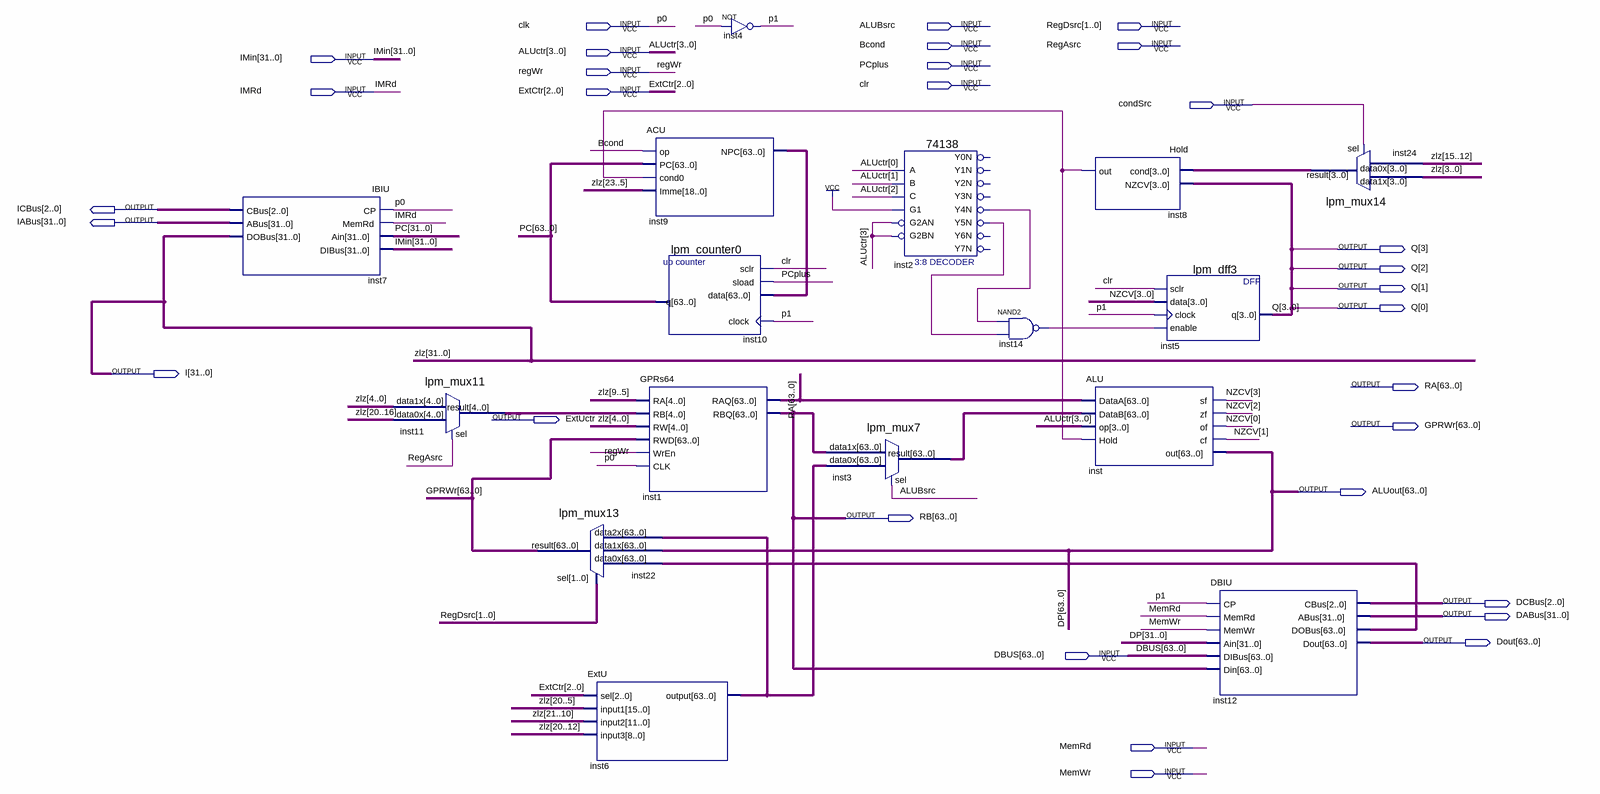
[diagram p0: schematic sheet]
// Quartus schematic DP.bdf as structural Verilog: 16 symbols, 31 pins
module DP (
  input  clk,
  input  ALUBsrc,
  input  [1:0] RegDsrc,
  input  Bcond,
  input  RegAsrc,
  input  [3:0] ALUctr,
  input  [31:0] IMin,
  input  PCplus,
  input  regWr,
  input  clr,
  input  IMRd,
  input  [2:0] ExtCtr,
  input  condSrc,
  input  [63:0] DBUS,
  input  MemRd,
  input  MemWr,
  output [2:0] ICBus,
  output [31:0] IABus,
  output [3:0] Q,
  output [31:0] I,
  output [63:0] RA,
  output ExtUctr,
  output [63:0] GPRWr,
  output [63:0] ALUout,
  output [63:0] RB,
  output [2:0] DCBus,
  output [31:0] DABus,
  output [63:0] Dout
);

  wire inst2_y4n, inst2_y5n, inst8_out, inst14_out, p1;
  wire [3:0] inst24_result, NZCV;
  wire [4:0] inst11_result;
  wire [63:0] inst3_result, inst6_output, inst9_npc, inst12_dobus, PC;

  IBIU inst7 (.CP(clk), .MemRd(IMRd), .Ain(PC[31:0]), .DIBus(IMin), .CBus(ICBus), .ABus(IABus), .DOBus(I));
  lpm_mux11 inst11 (.data1x(I[4:0]), .data0x(I[20:16]), .sel(RegAsrc), .result(inst11_result));
  lpm_mux13 inst22 (.data2x(inst6_output), .data1x(ALUout), .data0x(inst12_dobus), .sel(RegDsrc), .result(GPRWr));
  ExtU inst6 (.sel(ExtCtr), .input1(I[20:5]), .input2(I[21:10]), .input3(I[20:12]), .\output (inst6_output));
  ACU inst9 (.op(Bcond), .PC(PC), .cond0(inst8_out), .Imme(I[23:5]), .NPC(inst9_npc));
  lpm_counter0 inst10 (.sclr(clr), .sload(PCplus), .data(inst9_npc), .clock(p1), .q(PC));
  GPRs64 inst1 (.RA(I[9:5]), .RB(inst11_result), .RW(I[4:0]), .RWD(GPRWr), .WrEn(regWr), .CLK(clk), .RAQ(RA), .RBQ(RB));
  not inst4 (p1, clk);
  lpm_mux7 inst3 (.data1x(RB), .data0x(inst6_output), .sel(ALUBsrc), .result(inst3_result));
  \74138  inst2 (
    .A(ALUctr[0]), .B(ALUctr[1]), .G1(1'b1), .C(ALUctr[2]), .G2AN(ALUctr[3]), .G2BN(ALUctr[3]),
    .Y4N(inst2_y4n), .Y5N(inst2_y5n));  // open: Y0N, Y1N, Y2N, Y3N, Y6N, Y7N
  nand inst14 (inst14_out, inst2_y4n, inst2_y5n);
  Hold inst8 (.cond(inst24_result), .NZCV(Q), .out(inst8_out));
  ALU inst (
    .DataA(RA), .DataB(inst3_result), .op(ALUctr), .Hold(inst8_out), .sf(NZCV[3]), .zf(NZCV[2]),
    .of(NZCV[0]), .cf(NZCV[1]), .out(ALUout));
  lpm_dff3 inst5 (.sclr(clr), .data(NZCV), .clock(p1), .enable(inst14_out), .q(Q));
  DBIU inst12 (
    .CP(p1), .MemRd(MemRd), .MemWr(MemWr), .Ain(ALUout[31:0]), .DIBus(DBUS), .Din(RB), .CBus(DCBus),
    .ABus(DABus), .DOBus(inst12_dobus), .Dout(Dout));
  lpm_mux14 inst24 (.data1x(I[3:0]), .data0x(I[15:12]), .sel(condSrc), .result(inst24_result));

  // Other names for the same wires on the sheet: DP[63:0] = ALUout; p0 = clk; zlz[31:0] = I
endmodule
